# Altium schematic sheet USB Hub.SchDoc
size 420 x 297 mm; SheetNumber: 1; SheetTotal: 7
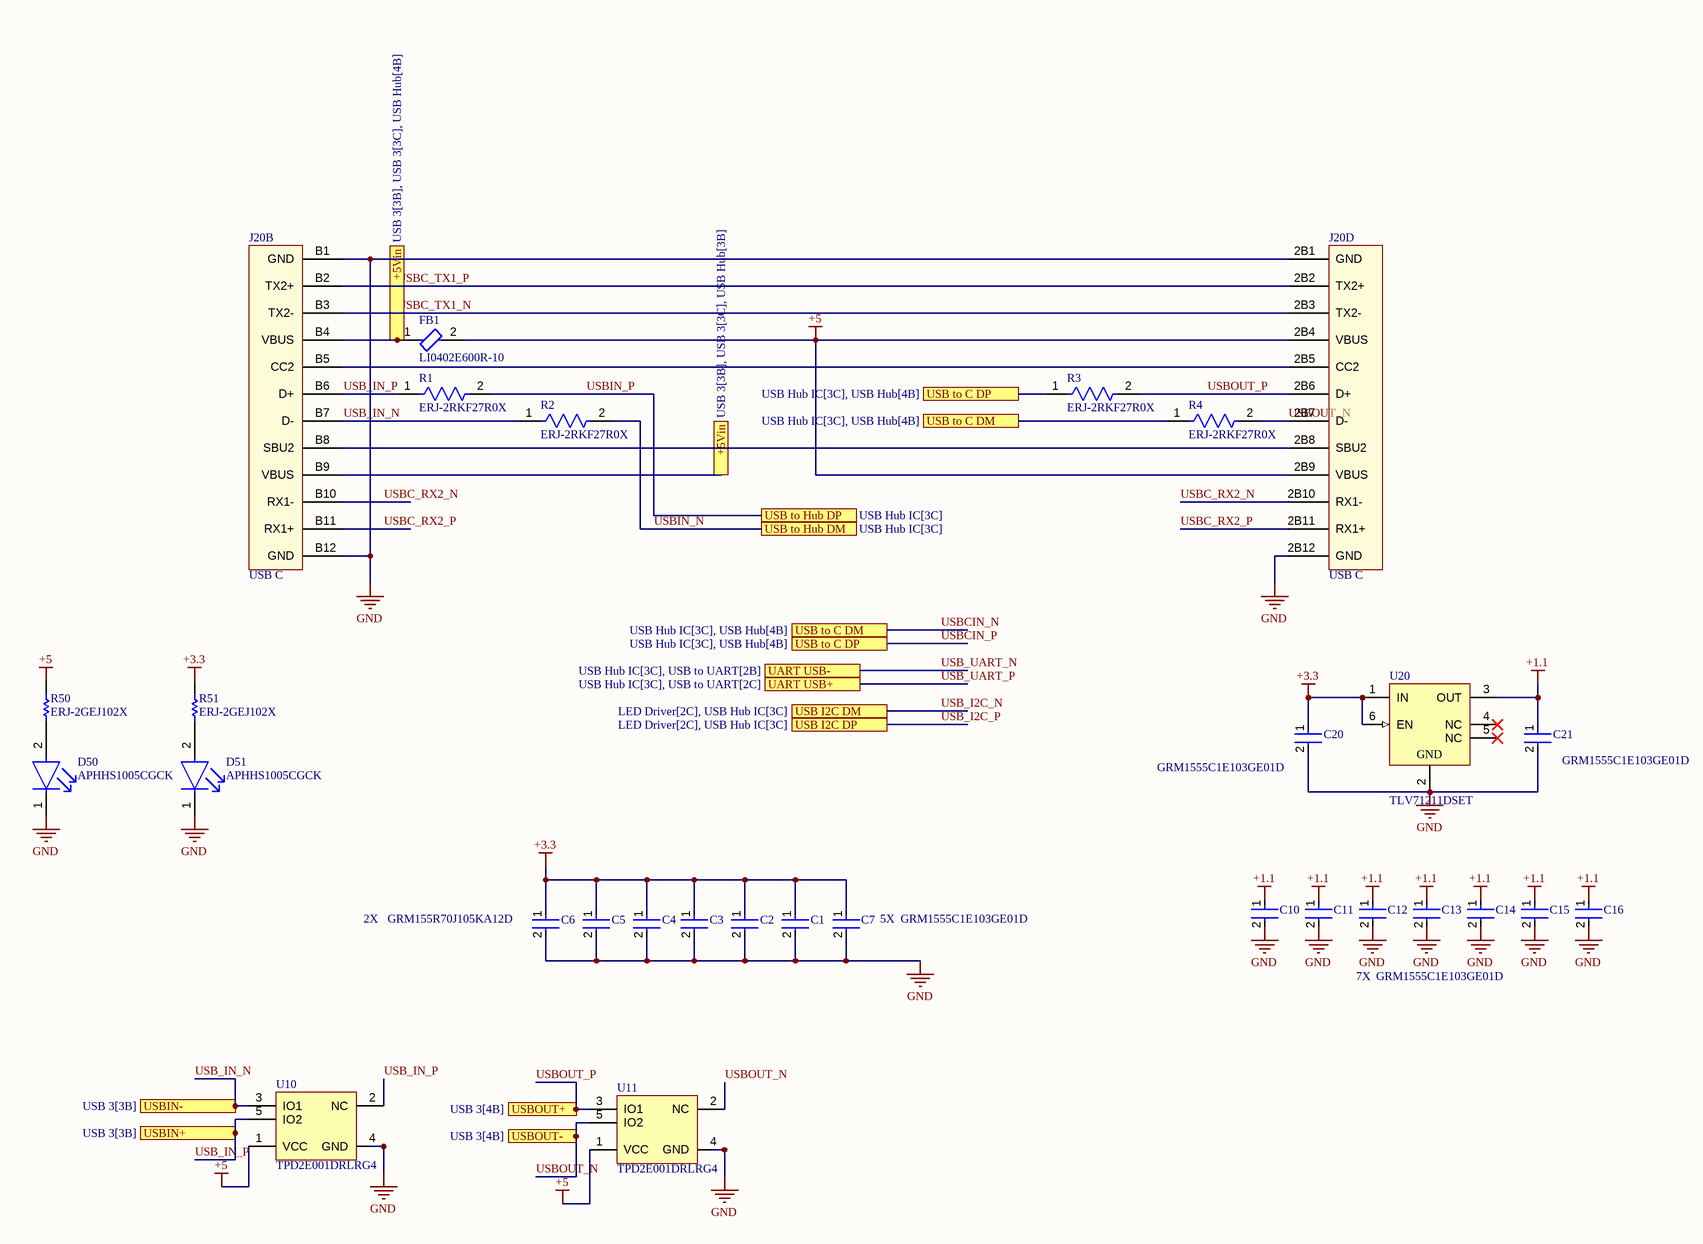
[diagram p0: USB Hub.SchDoc]

## Parts
C1  GRM1555C1E103GE01D  [FP-GRM155-0_15-IPC_B]  (value not drawn)
C2  GRM1555C1E103GE01D  [FP-GRM155-0_15-IPC_B]  (value not drawn)
C3  GRM1555C1E103GE01D  [FP-GRM155-0_15-IPC_B]  (value not drawn)
C4  GRM1555C1E103GE01D  [FP-GRM155-0_15-IPC_B]  (value not drawn)
C5  GRM155R70J105KA12D  [FP-GRM155-0_05-MFG]  (value not drawn)
C6  GRM155R70J105KA12D  [FP-GRM155-0_05-MFG]
C7  GRM1555C1E103GE01D  [FP-GRM155-0_15-IPC_B]
C10  GRM1555C1E103GE01D  [FP-GRM155-0_15-IPC_B]
C11  GRM1555C1E103GE01D  [FP-GRM155-0_15-IPC_B]  (value not drawn)
C12  GRM1555C1E103GE01D  [FP-GRM155-0_15-IPC_B]  (value not drawn)
C13  GRM1555C1E103GE01D  [FP-GRM155-0_15-IPC_B]  (value not drawn)
C14  GRM1555C1E103GE01D  [FP-GRM155-0_15-IPC_B]  (value not drawn)
C15  GRM1555C1E103GE01D  [FP-GRM155-0_15-IPC_B]  (value not drawn)
C16  GRM1555C1E103GE01D  [FP-GRM155-0_15-IPC_B]  (value not drawn)
C20  GRM1555C1E103GE01D  [FP-GRM155-0_15-IPC_B]
C21  GRM1555C1E103GE01D  [FP-GRM155-0_15-IPC_B]
D50  APHHS1005CGCK  [FP-APHHS1005CGCK-MFG]
D51  APHHS1005CGCK  [FP-APHHS1005CGCK-MFG]
FB1  LI0402E600R-10  [FP-LI0402-MFG]
J20  USB C  [Dual USB C Connector]  (parts B,D of 5)
R1  ERJ-2RKF27R0X  [FP-ERJ2R-IPC_B]
R2  ERJ-2RKF27R0X  [FP-ERJ2R-IPC_B]
R3  ERJ-2RKF27R0X  [FP-ERJ2R-IPC_B]
R4  ERJ-2RKF27R0X  [FP-ERJ2R-IPC_B]
R50  ERJ-2GEJ102X  [RESC1005X40X25NL05T05]
R51  ERJ-2GEJ102X  [RESC1005X40X25NL05T05]
U10  TPD2E001DRLRG4  [DRL0005A_L]
U11  TPD2E001DRLRG4  [DRL0005A_L]
U20  TLV71211DSET  [DSE0006A_V]

## Ports
+5Vin (see USB 3[3B], USB 3[3C], USB Hub[3B]), +5Vin (see USB 3[3B], USB 3[3C], USB Hub[4B]), UART USB+ (see USB Hub IC[3C], USB to UART[2C]), UART USB- (see USB Hub IC[3C], USB to UART[2B]), USB I2C DM (see LED Driver[2C], USB Hub IC[3C]), USB I2C DP (see LED Driver[2C], USB Hub IC[3C]), USB to C DM (see USB Hub IC[3C], USB Hub[4B]), USB to C DP (see USB Hub IC[3C], USB Hub[4B]), USB to Hub DM (see USB Hub IC[3C]), USB to Hub DP (see USB Hub IC[3C]), USBIN+ (see USB 3[3B]), USBIN- (see USB 3[3B]), USBOUT+ (see USB 3[4B]), USBOUT- (see USB 3[4B])

## Nets
+1.1: C10.1 C11.1 C12.1 C13.1 C14.1 C15.1 C16.1 C21.1 U20.3(OUT)
+3.3: C1.1 C2.1 C3.1 C4.1 C5.1 C6.1 C7.1 C20.1 R51.2 U20.1(IN) U20.6(EN)
+5: FB1.2 J20.2B4(VBUS) J20.2B9(VBUS) R50.2 U10.1(VCC) U11.1(VCC)
GND: C1.2 C2.2 C3.2 C4.2 C5.2 C6.2 C7.2 C10.2 C11.2 C12.2 C13.2 C14.2 C15.2 C16.2 C20.2 C21.2 D50.1(C) D51.1(C) J20.2B1(GND) J20.2B12(GND) J20.B1(GND) J20.B12(GND) U10.4(GND) U11.4(GND) U20.2(GND)
+5Vin: FB1.1 J20.B4(VBUS) J20.B9(VBUS) ; port +5Vin
USB_I2C_N: port USB I2C DM
USB_I2C_P: port USB I2C DP
USB_IN_N: J20.B7(D-) R2.1 U10.3(IO1) ; port USBIN-
USB_IN_P: J20.B6(D+) R1.1 U10.2(NC) U10.5(IO2) ; port USBIN+
USB_UART_N: port UART USB-
USB_UART_P: port UART USB+
USBC_RX2_N: J20.2B10(RX1-) J20.B10(RX1-)
USBC_RX2_P: J20.2B11(RX1+) J20.B11(RX1+)
USBC_TX1_N: J20.2B3(TX2-) J20.B3(TX2-)
USBC_TX1_P: J20.2B2(TX2+) J20.B2(TX2+)
USBCIN_N: R4.1 ; port USB to C DM
USBCIN_P: R3.1 ; port USB to C DP
USBIN_N: R2.2 ; port USB to Hub DM
USBIN_P: R1.2 ; port USB to Hub DP
USBOUT_N: J20.2B7(D-) R4.2 U11.2(NC) U11.5(IO2) ; port USBOUT-
USBOUT_P: J20.2B6(D+) R3.2 U11.3(IO1) ; port USBOUT+
NetD50_2: D50.2(A) R50.1
NetD51_2: D51.2(A) R51.1
NetJ20_2B5: J20.2B5(CC2) J20.B5(CC2)
NetJ20_2B8: J20.2B8(SBU2) J20.B8(SBU2)

Not connected (* = marked no-connect by the designer): U20 4(NC)* 5(NC)*

## Notes on the sheet
- 2X
- (near C7) 5X
- 7X
- CREATIVE COMMONS
- PUBLIC LICENSE:
- BARKOUR ROBOT
- CC BY-NC 4.0
- APPROVED
- DWG NO
- GOOGLE LLC
- FILE
- RELEASED
- 2024/05/09
- SIZE
- 1600 AMPHITHEATRE PARKWAY
- MOUNTAIN VIEW CA 94043
- A3
- SHEET
- OF
- THIS DESIGN IS BEING PROVIDED  FOR NON-COMMERCIAL USE ONLY. THE USE OF =SCIENTIST_NAME_POSSESSIVE NAME IN CONNECTION WITH THE DESIGN IS NOT INTENDED TO IMPLY THAT =SCIENTIST_NAME SPONSORS OR ENDORSES THE DESIGN, GOOGLE LLC, OR ANY OF GOOGLE LLC'S PRODUCTS OR SERVICES.

## Library data of the parts
C1-C4 C7 C10-C16 C20 C21 = CMP-06035-007392-1: Chip Multilayer Ceramic Capacitors for General Purpose, 0402, 10000pF, C0G, 30ppm/°C, 2%, 25V
C5 C6 = CMP-2008-04587-2: Chip Multilayer Ceramic Capacitors for General Purpose, 0402, 1.0uF, X7R, 15%, 10%, 6.3V; Capacitance: 1uF; Case Code (Metric): 1005; Min Operating Temperature: -55°C; Tolerance: 10%; Depth: 0.5mm; Max Operating Temperature: 125°C; Width: 0.5mm; Case Code (Imperial): 0402; Termination: SMD/SMT; Weight: 0.000212oz; Thickness: 0.022inch; Package Quantity: 10000; Packaging: Tape and Reel; Voltage Rating: 6.3V; Lead Free: Lead Free; Height: 0.5mm; Length: 1mm; Dielectric: X7R; Case/Package: 0402; Voltage Rating (DC): 6.3V; Material: Ceramic; Mount: Surface Mount
D50 D51 = CMP-44529-000044-1: LED GREEN CLEAR CHIP SMD; Viewing Angle: 120°; Dominant Wavelength: 570nm; Test Current: 20mA; Luminous Intensity: 50mcd; Forward Voltage: 2.1V; Number of LEDs: 1; Lens Color: Clear; Packaging: Tape and Reel; Max Operating Temperature: 85°C; Illumination Color: Green; Length: 1mm; Mount: Surface Mount; Lens Style: Clear; Color: Green; Number of Pins: 2; Wavelength: 570nm; Case/Package: 0402; Width: 0.5mm; Package Quantity: 2000; Case Code (Metric): 1005; Height: 0.6mm; Lead Free: Lead Free; Case Code (Imperial): 0402; Forward Current: 20mA; Min Operating Temperature: -40°C
FB1 = CMP-19111-000011-1: FERRITE BEAD 60 OHM 0402 1LN; Max DC Current: 500mA; Number of Lines: 1; DC Resistance (DCR): 300mR; Impedance: 60R; Test Frequency: 100MHz; Termination: SMD/SMT; Core Material: Ferrite; Min Operating Temperature: -40°C; Lead Free: Lead Free; Depth: 0.7mm; Max Operating Temperature: 125°C; Max Current Rating: 500mA; Case/Package: 0402; Packaging: Tape and Reel; Case Code (Metric): 1005; Package Quantity: 1; Case Code (Imperial): 0402; Frequency: 100MHz; Length: 0.04inch; Height: 0.028inch; Weight: 0.00192oz; Width: 0.02inch; Mount: Surface Mount
R1-R4 = CMP-2002-00830-2: RES SMD 27 OHM 1% 1/10W 0402; Voltage Rating: 50V; Temperature Coefficient: 100ppm/°C; Resistance: 27R; Power Rating: 100mW; Military Standard: Not; Construction: Rectangular; Tolerance: 1%; Features: Automotive AEC-Q200; Length: 1mm; Lead Free: Lead Free; Mount: Surface Mount; Number of Terminations: 2; Radiation Hardening: No; Number of Pins: 2; Width: 0.5mm; Contact Plating: Tin; Voltage Rating (DC): 50V; Resistance Tolerance: 1%; Series: ERJ; Packaging: Tape and Reel; Case/Package: 0402; Technology: THICK FILM; REACH SVHC: No SVHC; Depth: 0.5mm; Resistor Type: Thick Film; Package Quantity: 1; Termination: SMD/SMT; Case Code (Imperial): 0402; Height: 0.35mm; Weight: 2.8E-05oz; Max Operating Temperature: 155°C; Case Code (Metric): 1005; Min Operating Temperature: -55°C; RoHS Compliant: Yes; Max Power Dissipation: 100mW
R50 R51 = CMP-2002-00432-1: Manufacturer: Panasonic; Part Number: ERJ-2GEJ102X
U10 U11 = CMP-0326-00050-2: Low-Capacitance + / - 15 kV ESD-Protection Array for High-Speed Data Interfaces, 2 Channels, -40 to +85 degC, 5-pin SOT (DRL), Green (RoHS & no Sb/Br); Manufacturer: Texas Instruments; USB High Speed: TRUE; IO Leakage Current(nA): 1; IEC 61000-4-2 Contact(+/- kV): 8; Breakdown Voltage(Min)(V): 11; IEC 61000-4-2 Air-Gap(+/- kV): 15; IO Capacitance(Typ)(pF): 1.5; SubFamily: ESD Solution; Eco-Plan: Green (RoHS & no Sb/Br); PackageDescription: 5-Pin Plastic Small Outline, Flat Lead 0.5 mm Pitch; ComponentLink2Description: Datasheet; ComponentLink3URL: SamplesURL:http://www.ti.com/product/tpd2e001#samples; ComponentLink1URL: http://www.ti.com/; PartNumber: TPD2E001DRLRG4; DatasheetVersion: SLLS684F; PackageVersion: revD, Aug-2007; PackageReference: DRL0005A; ComponentLink2URL: http://www.ti.com/general/docs/lit/getliterature.tsp?genericPartNumber=TPD2E001&fileType=pdf; Mounting Technology: Surface Mount; ComponentLink1Description: Manufacturer URL; ComponentLink3Description: URL Link1
U20 = CMP-0394-01454-2: Single Output LDO, 300 mA, Fixed 1.1 V Output, 2 to 5.5 V Input, with Low IQ, 6-pin WSON (DSE), -40 to 125 degC, Green (RoHS & no Sb/Br); Manufacturer: Texas Instruments; SubFamily: Single Channel LDO; Iout(Max)(A): 0.3; Iq(Typ)(mA): 0.035; Vin(Min)(V): 2; Fixed Output Options(V): 1.1; Vdo(Typ)(mV): 260; Vin(Max)(V): 5.5; ComponentLink2Description: Datasheet; PackageVersion: 4207810/A; PackageDescription: 6-Pin Plastic Small Outline, Body 1.5 x 1.5 mm, Pitch 0.5 mm; ComponentLink1Description: Manufacturer URL; ComponentLink3Description: Package Specification; Mounting Technology: Surface Mount; Accuracy(%): 2; ComponentLink2URL: http://www.ti.com/general/docs/lit/getliterature.tsp?genericPartNumber=TLV71211&fileType=pdf; Vout Adj(Min)(V): 1.1; ComponentLink3URL: http://www.ti.com/litv/pdf/mpds287; PackageReference: DSE0006A; ComponentLink1URL: http://www.ti.com/; Eco-Plan: Green (RoHS & no Sb/Br); Vout Adj(Max)(V): 1.1; PartNumber: TLV71211DSET; DatasheetVersion: SBVS150A